# EAGLE design Brickster 8884bt Receiver (EAGLE 6.5.0)
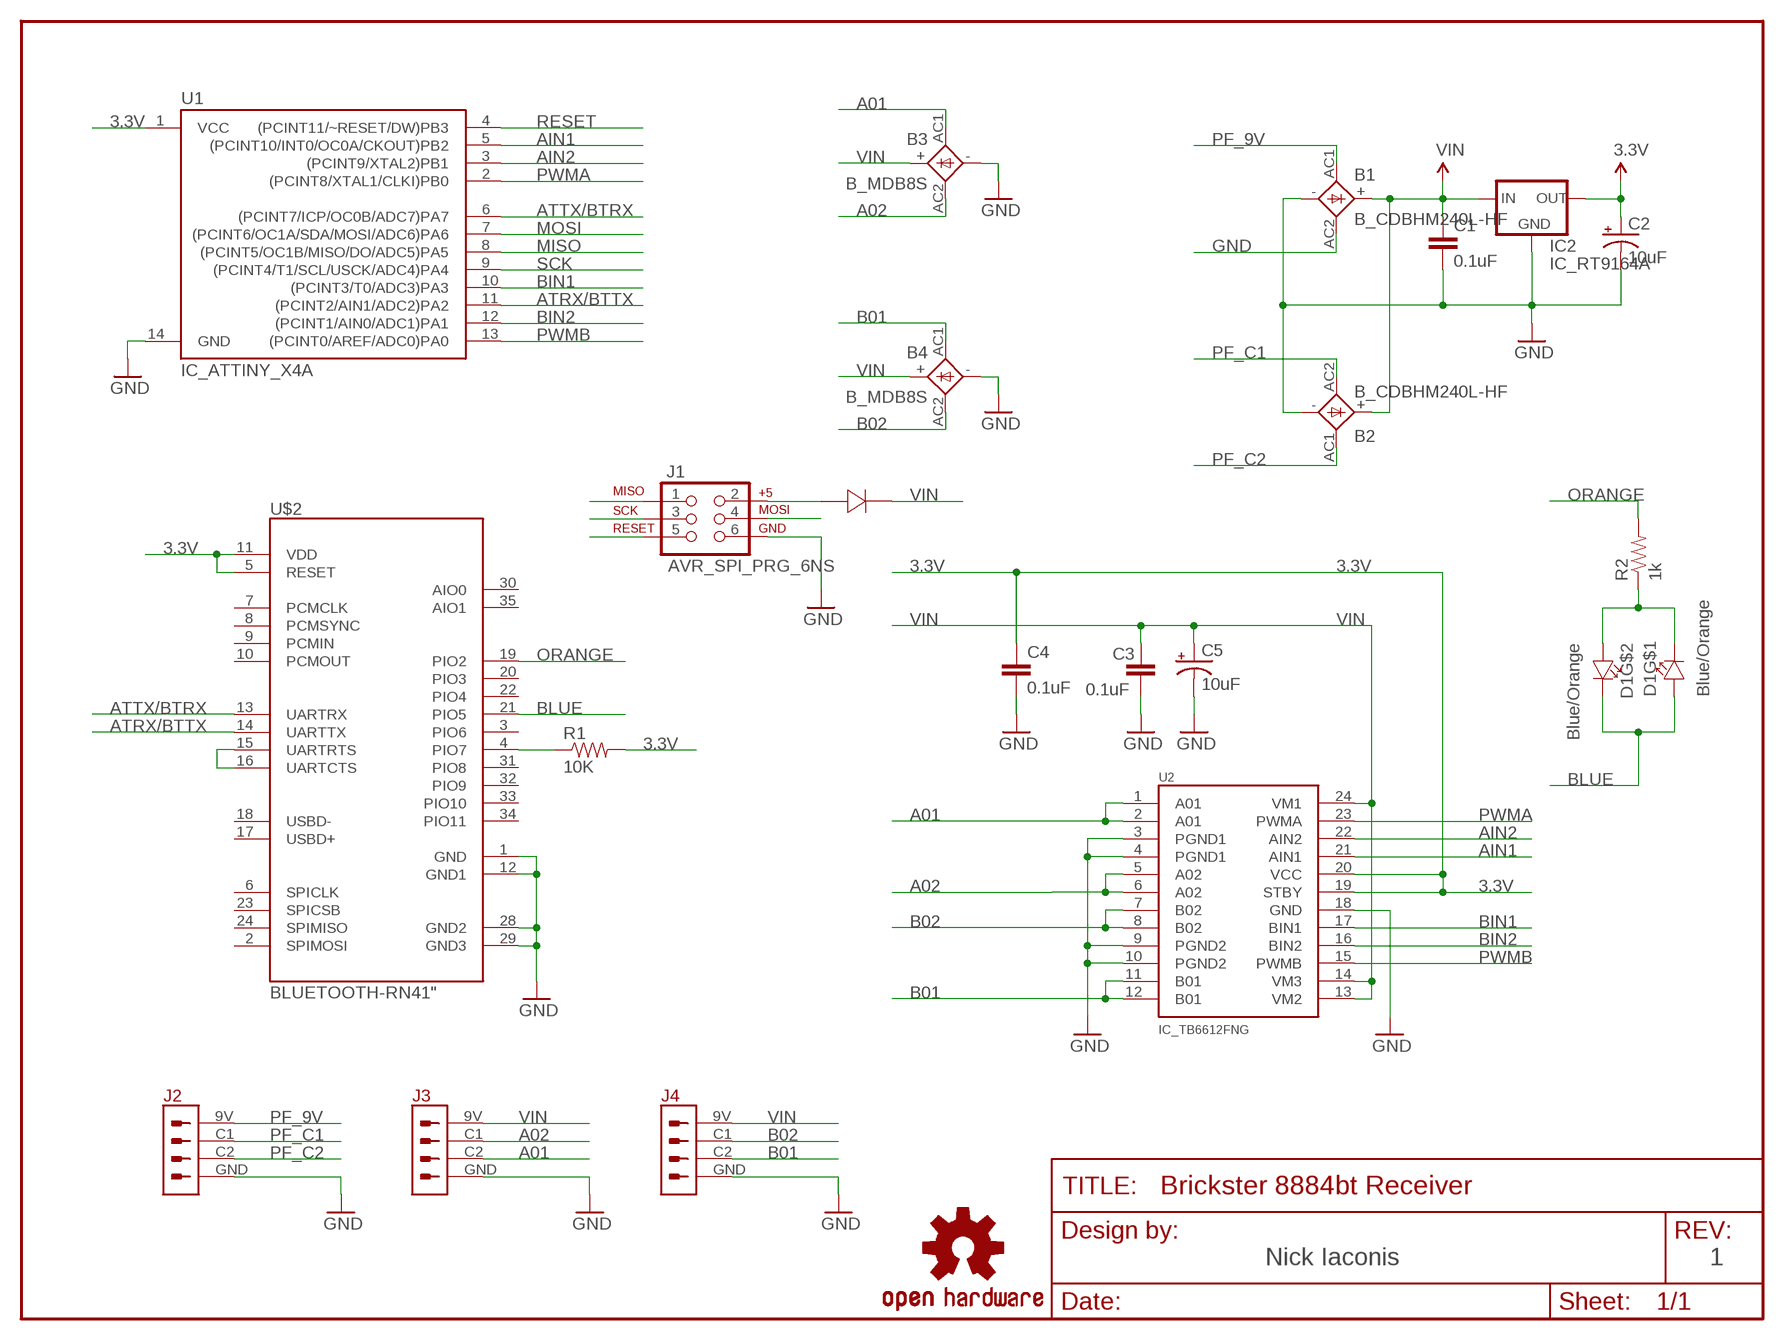
[diagram p0: schematic, sheet 1]

## Parts
B1  B_CDBHM240L-HF  [MBS-2]
B2  B_CDBHM240L-HF  [MBS-2]
B3  B_MDB8S  [MICRO-DIP]
B4  B_MDB8S  [MICRO-DIP]
C1  0.1uF  C  [0402]
C2  10uF  C_POL  [1206]
C3  0.1uF  C  [0402]
C4  0.1uF  C  [0402]
C5  10uF  C_POL  [1206]
D1  Blue/Orange  LED_LTST_C195TBKFKT  [CHIP-LTST]
D2  D  [SOD80]
IC2  IC_RT9164A  [SOT223]
J1  AVR_SPI_PRG_6NS  [2X3-NS]
J2  CON_PF  [CON_PF]
J3  CON_PF  [CON_PF]
J4  CON_PF  [CON_PF]
LOGO1  OSHW-LOGOM  [OSHW-LOGO-M]
R1  10K  R  [0402]
R2  1k  R  [0402]
U1  IC_ATTINY_X4A  [14S1]
U2  IC_TB6612FNG  [SSOP24]
U$2  BLUETOOTH-RN41"  [RN41]

## Nets
3.3V: C2.1(+) C4.1 IC2.2(OUT) R1.2 U1.1(VCC) U2.19(STBY) U2.20(VCC) U$2.5(RESET) U$2.11(VDD)
A01: B3.AC1 J3.C2 U2.1(A01) U2.2(A01)
A02: B3.AC2 J3.C1 U2.5(A02) U2.6(A02)
AIN1: U1.5((PCINT10/INT0/OC0A/CKOUT)PB2) U2.21(AIN1)
AIN2: U1.3((PCINT9/XTAL2)PB1) U2.22(AIN2)
ATRX/BTTX: U1.11((PCINT2/AIN1/ADC2)PA2) U$2.14(UARTTX)
ATTX/BTRX: U1.6((PCINT7/ICP/OC0B/ADC7)PA7) U$2.13(UARTRX)
B01: B4.AC1 J4.C2 U2.11(B01) U2.12(B01)
B02: B4.AC2 J4.C1 U2.7(B02) U2.8(B02)
BIN1: U1.10((PCINT3/T0/ADC3)PA3) U2.17(BIN1)
BIN2: U1.12((PCINT1/AIN0/ADC1)PA1) U2.16(BIN2)
BLUE: D1.1 D1.4 U$2.21(PIO5)
GND: B1.- B1.AC2 B2.- B3.- B4.- C1.2 C2.2(-) C3.2 C4.2 C5.2(-) IC2.1(GND) J1.6 J2.GND J3.GND J4.GND U1.14(GND) U2.3(PGND1) U2.4(PGND1) U2.9(PGND2) U2.10(PGND2) U2.18(GND) U$2.1(GND) U$2.12(GND1) U$2.28(GND2) U$2.29(GND3)
MISO: J1.1 U1.8((PCINT5/OC1B/MISO/DO/ADC5)PA5)
MOSI: J1.4 U1.7((PCINT6/OC1A/SDA/MOSI/ADC6)PA6)
N$1: D2.1 J1.2
N$7: U$2.15(UARTRTS) U$2.16(UARTCTS)
N$15: R1.1 U$2.4(PIO7)
N$16: D1.2 D1.3 R2.1
ORANGE: R2.2 U$2.19(PIO2)
PF_9V: B1.AC1 J2.9V
PF_C1: B2.AC2 J2.C1
PF_C2: B2.AC1 J2.C2
PWMA: U1.2((PCINT8/XTAL1/CLKI)PB0) U2.23(PWMA)
PWMB: U1.13((PCINT0/AREF/ADC0)PA0) U2.15(PWMB)
RESET: J1.5 U1.4((PCINT11/~RESET/DW)PB3)
SCK: J1.3 U1.9((PCINT4/T1/SCL/USCK/ADC4)PA4)
VIN: B1.+ B2.+ B3.+ B4.+ C1.1 C3.1 C5.1(+) D2.2 IC2.3(IN) J3.9V J4.9V U2.13(VM2) U2.14(VM3) U2.24(VM1)
Unconnected: U$2.2(SPIMOSI) U$2.3(PIO6) U$2.6(SPICLK) U$2.7(PCMCLK) U$2.8(PCMSYNC) U$2.9(PCMIN) U$2.10(PCMOUT) U$2.17(USBD+) U$2.18(USBD-) U$2.20(PIO3) U$2.22(PIO4) U$2.23(SPICSB) U$2.24(SPIMISO) U$2.30(AIO0) U$2.31(PIO8) U$2.32(PIO9) U$2.33(PIO10) U$2.34(PIO11) U$2.35(AIO1)

## Notes on the sheet
- Nick Iaconis | 1

## Library data of the parts
B1 B2 = brickster:B_CDBHM240L-HF
B3 B4 = brickster:B_MDB8S
C1 C3 C4 = brickster:C
C2 C5 = brickster:C_POL
D1 = brickster:LED_LTST_C195TBKFKT
D2 = brickster:D
IC2 = brickster:IC_RT9164A
J1 = SparkFun-Connectors:AVR_SPI_PRG_6: AVR ISP 6 Pin This is the reduced ISP connector for AVR programming. Common on Arduino. This footprint will take up less PCB space and can be used with a 10-pin to 6-pin adapter such as SKU: BOB-08508
J2-J4 = brickster:CON_PF
LOGO1 = SparkFun-Aesthetics:OSHW-LOGO: Open Source Hardware Logo This logo indicates the piece of hardware it is found on incorporates a OSHW license and/or adheres to the definition of open source hardware found here: http://freedomdefined.org/OSHW
R1 R2 = brickster:R
U1 = brickster:IC_ATTINY_X4A: Atmel ATtiny24A/44A/84A
U2 = brickster:IC_TB6612FNG
U$2 = SparkFun-RF:BLUETOOTH-RN41: Bluetooth SMD module

## Board
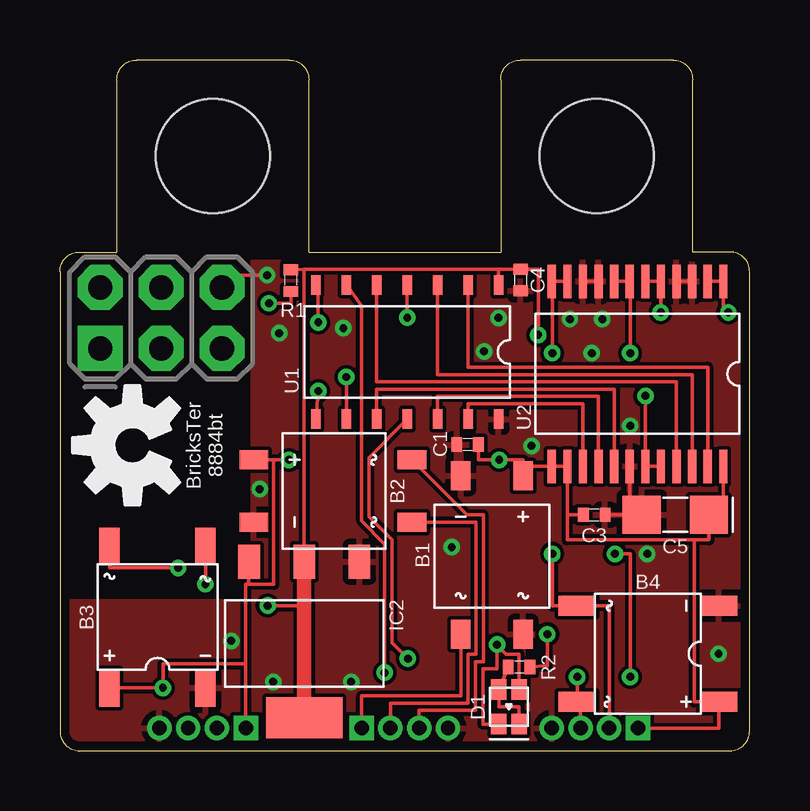
[diagram p1: board, top side]
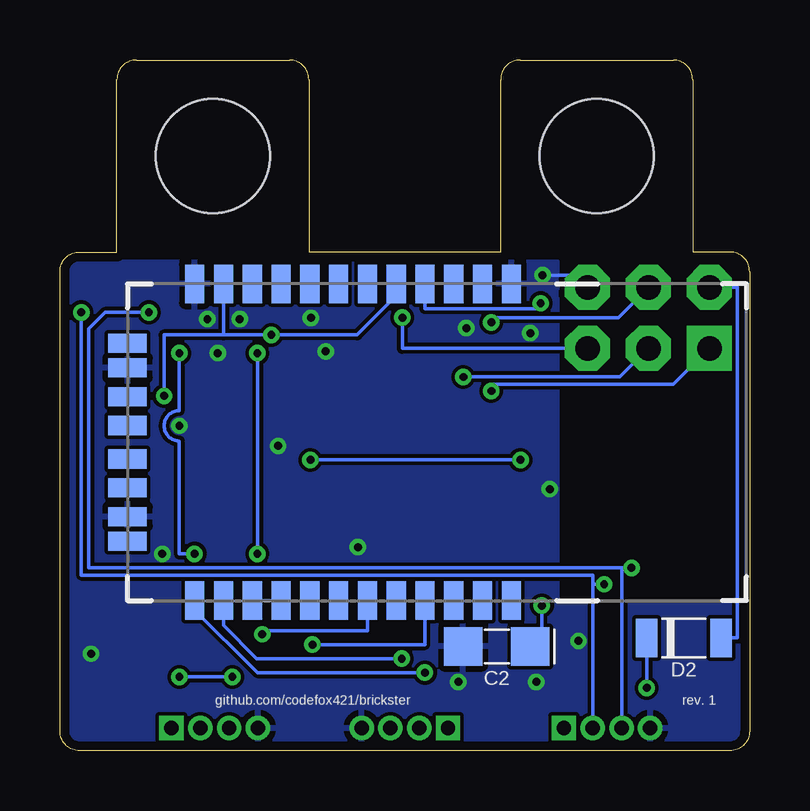
[diagram p2: board, bottom side, seen from below]

Size 28.75 x 28.78 mm. Coordinates in mm from the lower left corner, seen from the top.
Outline: 0.81,0 27.94,0 arc90 28.75,0.81 28.75,19.96 arc90 27.94,20.78 26.38,20.78 26.38,27.96 arc90 25.57,28.78 19.19,28.78 arc90 18.38,27.96 18.38,20.78 10.38,20.78 10.38,27.96 arc90 9.56,28.78 3.19,28.78 arc90 2.38,27.96 2.38,20.78 0.81,20.78 arc90 0,19.96 0,0.81 arc90 0.81,0
Copper layers (1*16): Top 0.0356mm / dielectric 1.5011mm / Bottom 0.0356mm
Design rules "LaenPCBOrder *": minimum track width 6mil, minimum drill 13mil, track to track 6mil, track to pad 6mil, pad to pad 6mil, via to via 6mil, smd to smd 6mil, copper to edge 15mil, drill to drill 6mil, minimum pad ring 7mil, minimum via ring 7mil, stop-mask expansion 4mil, vias tented up to drill 13mil, thermal gap 10mil
Holes 4.75 mm at 6.38,24.78 22.38,24.78

### Footprints (pad centres in the part's own frame; a part is rotated, then mirrored left to right if it is on the bottom)
MBS-2 = smd 0.8 x 1.2: + 1.3,3.3; - -1.3,3.3; AC1 -1.3,-3.3; AC2 1.3,-3.3
MICRO-DIP = smd 0.85 x 1.55: + 2,2.95; - -2,2.95; AC1 -2,-2.95; AC2 2,-2.95
0402 = smd 0.45 x 0.6: 1 -0.45,0; 2 0.45,0
1206 = smd 1.6 x 1.6: 1 -1.4,0; 2 1.4,0
CHIP-LTST = smd 0.65 x 0.85: 1 0.425,0.725; 2 -0.425,0.725; 3 0.425,-0.725; 4 -0.425,-0.725
SOD80 = smd 0.9 x 1.6: 1 -1.55,0; 2 1.55,0
SOT223 = smd 0.9 x 1.4: 1 -2.3,-3.4; 2 0,-3.4; 3 2.3,-3.4 | smd 3.2 x 1.7: 4 0,3.1
2X3-NS = drill 1.016 pad 1.88 square: 1 -2.54,-1.27 | drill 1.016 pad 1.88 octagon: 2 -2.54,1.27; 3 0,-1.27; 4 0,1.27; 5 2.54,-1.27; 6 2.54,1.27
CON_PF = drill 0.6 pad 1.016 square: 9V -1.8,0 | drill 0.6 pad 1.016: C1 0.6,0; C2 -0.6,0; GND 1.8,0
14S1 = smd 0.813 x 0.406: 1 -2.8,3.81; 2 -2.8,2.54; 3 -2.8,1.27; 4 -2.8,0; 5 -2.8,-1.27; 6 -2.8,-2.54; 7 -2.8,-3.81; 8 2.8,-3.81; 9 2.8,-2.54; 10 2.8,-1.27; 11 2.8,0; 12 2.8,1.27; 13 2.8,2.54; 14 2.8,3.81
SSOP24 = smd 0.348 x 1.397: 1 -3.575,-3.856; 2 -2.925,-3.856; 3 -2.275,-3.856; 4 -1.625,-3.856; 5 -0.975,-3.856; 6 -0.325,-3.856; 7 0.325,-3.856; 8 0.975,-3.856; 9 1.625,-3.856; 10 2.275,-3.856; 11 2.925,-3.856; 12 3.575,-3.856; 13 3.575,3.856; 14 2.925,3.856; 15 2.275,3.856; 16 1.625,3.856; 17 0.975,3.856; 18 0.325,3.856; 19 -0.325,3.856; 20 -0.975,3.856; 21 -1.625,3.856; 22 -2.275,3.856; 23 -2.925,3.856; 24 -3.575,3.856
RN41 = smd 0.8 x 1.6: 1 -6.6,-6.6; 2 -5.4,-6.6; 3 -4.2,-6.6; 4 -3,-6.6; 5 -1.8,-6.6; 6 -0.6,-6.6; 7 0.6,-6.6; 8 1.8,-6.6; 9 3,-6.6; 10 4.2,-6.6; 11 5.4,-6.6; 12 6.6,-6.6; 13 6.6,6.6; 14 5.4,6.6; 15 4.2,6.6; 16 3,6.6; 17 1.8,6.6; 18 0.6,6.6; 19 -0.6,6.6; 20 -1.8,6.6; 21 -3,6.6; 22 -4.2,6.6; 23 -5.4,6.6; 24 -6.6,6.6 | smd 1.6 x 0.8: 28 9.4,3.1; 29 9.4,-3.1; 30 9.4,4.122; 31 9.4,1.9; 32 9.4,0.7; 33 9.4,-0.7; 34 9.4,-1.9; 35 9.4,-4.122

### Placement (x,y rotation side)
B1  18.01,8.15 0 top
B2  11.38,10.82 90 top
B3  4.06,5.56 180 top
B4  24.51,4.04 270 top
C1  16.99,12.75 180 top
C2  10.54,4.34 180 bottom
C3  22.28,9.83 0 top
C4  19.2,19.61 270 top
C5  25.65,9.83 180 top
D1  18.72,1.83 0 top
D2  2.74,4.7 180 bottom
IC2  10.19,4.47 180 top
J1  4.22,18.03 0 top
J2  14.38,0.94 0 top
J3  5.94,0.94 180 top
J4  22.3,0.94 180 top
LOGO1  3.02,12.73 90 top
R1  9.63,19.58 90 top
R2  19.14,3.49 0 top
U1  14.48,16.61 270 top
U2  24.08,15.7 180 top
U$2  16.54,12.85 180 bottom

### Tracks (layer width: path | path; a pad name or v marks a point on that pad's centre or on a via)
3.3V  (via drill 0.33)
  Top 0.152: 10.19,20.07 18.29,20.07 18.29,20.06 | 10.19,20.07 IC2.2 | v8.66,6.04 10.19,6.04 | v19.94,17.32 19.94,20.06 C4.1 18.29,20.06 | v24.41,14.78 U2.19 | U2.19 U2.20 | 18.29,20.06 U1.1 | 10.19,20.07 9.63,20.04 R1.2 | U2.19
  Top 0.61: IC2.2 10.19,6.07 10.19,6.04 10.19,1.73
  Bottom 0.152: C2.1 8.66,4.34 v8.66,6.04 | 21.93,17.32 v19.94,17.32 16.36,17.32 14.73,18.95 U$2.5 | 21.93,17.32 24.41,17.32 v24.41,14.78 | U$2.11 21.93,17.32
A01  (via drill 0.33)
  Top 0.152: U2.2 U2.1 27.66,19.55 | 27.66,19.58 27.66,19.55 | v27.86,18.26 27.66,18.47 27.66,19.51 27.66,19.55 | B3.AC1 v6.06,6.93
  Bottom 0.152: v27.86,18.26 27.86,7.32 6.54,7.32 6.54,6.93 | 6.54,6.93 J3.C2 | v6.06,6.93 6.54,6.93
A02  (via drill 0.33)
  Top 0.152: U2.6 U2.5 25.05,18.26 v25.04,18.26 | B3.AC2 2.06,7.62 v4.93,7.62
  Bottom 0.152: v25.04,18.26 26.87,18.26 27.56,17.58 27.56,7.62 5.33,7.62 | 5.33,7.62 J3.C1 | v4.93,7.62 5.33,7.62
AIN1
  Top 0.152: U1.5 13.21,15.37 25.7,15.37 U2.21
AIN2
  Top 0.152: U1.3 15.75,15.67 26.35,15.67 U2.22
ATRX/BTTX  (via drill 0.33)
  Top 0.152: v14.5,3.83 13.84,4.5 13.84,8.79 12.88,9.75 12.88,12.21 U1.11
  Bottom 0.152: U$2.14 21.93,5.22 20.55,3.83 v14.5,3.83
ATTX/BTRX  (via drill 0.33)
  Top 0.152: v13.54,3.25 13.54,8.61 12.57,9.58 12.57,18.55 U1.6
  Bottom 0.152: U$2.13 23.24,5.96 20.52,3.25 v13.54,3.25
B01  (via drill 0.33)
  Top 0.152: U2.12 U2.11 20.52,19.55 v20.52,16.56 | J4.C2 22.9,6.04 B4.AC1 | B4.AC1 | v20.52,8.2 20.52,6.04 B4.AC1
  Bottom 0.152: v20.52,16.56 v20.52,8.2
B02  (via drill 0.33)
  Top 0.152: U2.7 U2.8 23.77,19.55 v23.77,16.56 | J4.C1 21.7,2.04 B4.AC2 v21.57,3.07 | v23.14,8.2 23.77,8.2 23.77,8 v23.77,3.07
  Bottom 0.152: v23.77,16.56 23.77,14.17 arc-180 23.77,12.9 23.77,8.2 v23.14,8.2 | v23.77,3.07 v21.57,3.07
BIN1
  Top 0.152: U1.10 13.21,15.06 23.1,15.06 U2.17
BIN2
  Top 0.152: U1.12 15.75,14.76 22.45,14.76 U2.16
BLUE  (via drill 0.33)
  Top 0.152: D1.1 19.14,4.03 18.59,4.03 v18.22,4.42 18.21,3.4 17.63,3.4 17.63,1.1 D1.4
  Bottom 0.152: v18.22,4.42 13.54,4.42 U$2.21
GND  (via drill 0.33)
  Top 0.152: U2.18 23.75,9.83 | 23.75,9.83 C5.2 | 23.75,9.83 C3.2 | U2.10 U2.9 | U2.3 U2.4 | J1.6 7.26,19.81 v8.64,19.81
  Bottom 0.152: J1.6 7.26,19.81 v8.64,19.81
  other vias: 23.77,13.54 27.46,4.04 24.49,8.2 22.17,16.56 18.29,18.03 17.68,16.64 21.26,17.98 22.61,17.98 11.81,17.6 9.14,17.4 8.33,10.9 7.14,4.57 8.89,2.87 16.33,8.48 19.66,12.7 12.14,2.87
  pour Bottom: 0.38,0.38 28.37,0.38 28.37,20.4 8,20.4 8,19.46 8,6.25 2.82,6.25 0.38,6.25
  pour Top: 0.38,0.38 28.37,0.38 28.37,20.4 8,20.4 8,19.46 8,6.25 2.82,6.25 0.38,6.25
MISO  (via drill 0.33)
  Top 0.152: v10.77,14.99 U1.8
  Bottom 0.152: J1.1 3.17,15.27 10.77,15.27 v10.77,14.99
MOSI  (via drill 0.33)
  Top 0.152: v10.77,17.84 10.77,19.41 U1.7
  Bottom 0.152: J1.4 5.47,18.05 10.57,18.05 v10.77,17.84
N$1
  Bottom 0.152: J1.2 0.51,19.3 0.51,4.7 D2.1
N$7
  Bottom 0.152: U$2.16 U$2.15
N$15  (via drill 0.33)
  Top 0.152: v8.71,18.64 9.63,18.64 R1.1
  Bottom 0.152: U$2.4 13.54,18.41 8.71,18.41 v8.71,18.64
N$16
  Top 0.152: D1.3 19.14,1.83 18.3,1.83 D1.2 R2.1
ORANGE  (via drill 0.33)
  Top 0.152: R2.2 20.32,3.53 v20.32,4.85
  Bottom 0.152: v20.32,4.85 20.17,5 15.94,5 U$2.19
PF_9V
  Top 0.152: J2.9V 12.58,2.29 16.71,2.29 B1.AC1
PF_C1
  Top 0.152: J2.C1 14.98,1.68 17.32,1.68 17.32,3.71 17.65,3.71 17.65,9.83 16.97,9.83 B2.AC2
PF_C2
  Top 0.152: J2.C2 13.78,1.98 17.02,1.98 17.02,4.01 17.35,4.01 17.35,9.52 B2.AC1
PWMA
  Top 0.152: U1.2 17.02,15.98 27,15.98 U2.23
PWMB
  Top 0.152: U1.13 17.02,14.45 21.8,14.45 U2.15
RESET  (via drill 0.33)
  Top 0.152: v14.48,18.05 U1.4
  Bottom 0.152: J1.5 14.48,16.76 v14.48,18.05
SCK  (via drill 0.33)
  Top 0.152: v11.94,15.57 U1.9
  Bottom 0.152: J1.3 5.41,15.57 v11.94,15.57
VIN  (via drill 0.33)
  Top 0.152: 26.44,8.79 27.05,8.79 C5.1 27.65,9.83 U2.24 | 26.44,8.79 21.15,8.79 21.15,9.83 | B2.+ 8.91,12.12 | 8.91,12.12 8.91,6.93 7.87,6.93 | 7.87,6.93 7.74,6.93 7.74,3.63 | 7.74,3.63 J3.9V | IC2.3 7.87,6.93 | J4.9V 27.46,0.94 B4.+ 26.44,2.04 26.44,8.79 | 8.91,12.12 v9.55,12.12 | C1.1 17.44,12.12 v18.31,12.12 19.31,12.12 B1.+ 19.31,11.84 U2.13 U2.14 21.15,9.83 | 21.15,9.83 C3.1 | B3.+ v4.29,2.62 4.29,3.63 7.74,3.63
  Bottom 0.152: v9.55,12.12 v18.31,12.12 | D2.2 v4.29,2.62

### Text on the board
tPlace: BricksTer / 8884bt
bPlace: rev. 1 | github.com/codefox421/brickster